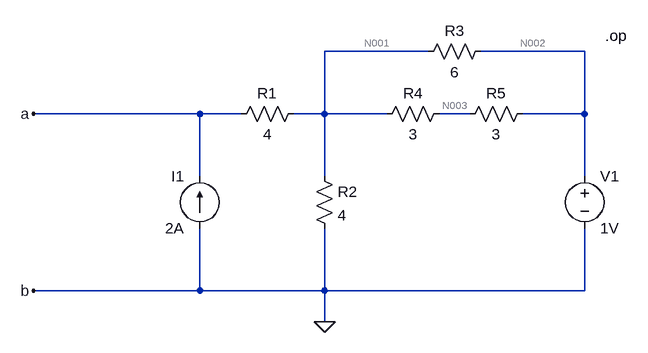
[diagram p0: schematic circuit.asc]
circuit.asc, the LTspice schematic file:
Version 4
SHEET 1 1124 772
WIRE 464 144 304 144
WIRE 704 144 544 144
WIRE 112 240 -144 240
WIRE 176 240 112 240
WIRE 304 240 304 144
WIRE 304 240 256 240
WIRE 400 240 304 240
WIRE 528 240 480 240
WIRE 704 240 704 144
WIRE 704 240 608 240
WIRE 112 336 112 240
WIRE 304 336 304 240
WIRE 704 336 704 240
WIRE 112 512 112 416
WIRE 112 512 -144 512
WIRE 304 512 304 416
WIRE 304 512 112 512
WIRE 704 512 704 416
WIRE 704 512 304 512
WIRE 304 560 304 512
FLAG -144 240 a
FLAG -144 512 b
FLAG 304 560 0
SYMBOL voltage 704 320 R0
WINDOW 123 0 0 Left 0
WINDOW 39 0 0 Left 0
SYMATTR InstName V1
SYMATTR Value 1V
SYMBOL current 112 416 R180
WINDOW 0 24 80 Left 2
WINDOW 3 24 0 Left 2
SYMATTR InstName I1
SYMATTR Value 2A
SYMBOL res 496 224 R90
WINDOW 0 0 56 VBottom 2
WINDOW 3 32 56 VTop 2
SYMATTR InstName R4
SYMATTR Value 3
SYMBOL res 624 224 R90
WINDOW 0 0 56 VBottom 2
WINDOW 3 32 56 VTop 2
SYMATTR InstName R5
SYMATTR Value 3
SYMBOL res 272 224 R90
WINDOW 0 0 56 VBottom 2
WINDOW 3 32 56 VTop 2
SYMATTR InstName R1
SYMATTR Value 4
SYMBOL res 560 128 R90
WINDOW 0 0 56 VBottom 2
WINDOW 3 32 56 VTop 2
SYMATTR InstName R3
SYMATTR Value 6
SYMBOL res 288 320 R0
SYMATTR InstName R2
SYMATTR Value 4
TEXT 736 120 Left 2 !.op

The netlist it stands for:
* circuit.asc
V1 N002 0 1V
I1 0 a 2A
R4 N003 N001 3
R5 N002 N003 3
R1 N001 a 4
R3 N002 N001 6
R2 N001 0 4
.op
.backanno
.end

* Results of the author's LTspice run, read from the files saved beside the schematic
* Operating Point:
*   V(n002) = 1 V
*   V(a) = 12 V
*   V(n003) = 2.5 V
*   V(n001) = 4 V
*   I(I1) = 2 A
*   I(R2) = 1 A
*   I(R3) = -500 mA
*   I(R1) = -2 A
*   I(R5) = -500 mA
*   I(R4) = -500 mA
*   I(V1) = 1 A